# Altium project eeprom.PrjPcb
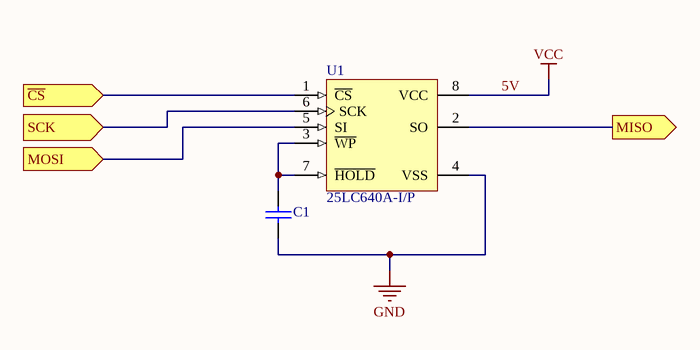
[diagram p0: eeprom.SchDoc]
1 sheet, 2 parts. Net scope: flat (ports and power ports of the same name join across sheets).

## Sheet eeprom.SchDoc: Sensors
size A4; ApprovedBy: Othniel Konan; CheckedBy: Othniel Konan; Author: Othniel Konan; DrawnBy: Othniel Konan; Engineer: Othniel Konan; Address1: NPSC; Address2: Othniel Konan; Address3: ECE 2017; DocumentNumber: 1; Revision: 1.0; SheetNumber: 1; SheetTotal: 1; ProjectName: NPSC

### Parts
C1  CAP 0.5pF 10V 0805(2012)  [CAPC0805(2012)100_L]  (value not drawn)
U1  25LC640A-I/P  [PDIP300-P8]

### Ports
MISO (out), MOSI (in), SCK (in), ~{CS} (in)

### Nets
5V: U1.8(VCC)  [also labelled VCC]
GND: C1.1 U1.4(VSS)
NetC1_2: C1.2 U1.3(~{WP}) U1.7(~{HOLD})
NetU1_1: U1.1(~{CS}) ; port ~{CS}
NetU1_2: U1.2(SO) ; port MISO
NetU1_5: U1.5(SI) ; port MOSI
NetU1_6: U1.6(SCK) ; port SCK

### Notes on the sheet
- Title
- Size:
- Date:
- A4
- Number:
- Time:
- Revision:
- Sheet
- of
- File:

### Library data of the parts
C1 = CMP-1036-00005-1: CAP 0.5pF 10V ±0.5pF 0805 (2012 Metric) Thickness 1mm SMD; Case-Metric: 2012; Case-EIA: 0805; Tolerance: Â±0.5pF; Rated Voltage: 10 V; Max Thickness: 1 mm; Technology: SMT; Value: 0.5pF
U1 = CMP-0165-00043-1: 64K SPI Bus Serial EEPROM, 8-Pin PDIP, Industrial Temperature; PackageDescription: 8-Lead Plastic Dual In-Line (P) - 300 mil Body [PDIP]; PackageReference: PDIP300-P8; Code_JEDEC: MS-001; PackageVersion: revBB, Aug-2009; DatasheetVersion: revD, Oct-2008